# EasyEDA schematic SCH_PresenceIndicator_2021-10-22.json
TITLE: Presence Indicator; REV: 0.1; Date: 2021-10-22; Sheet: 1/1; Company: Pedro Torrezão
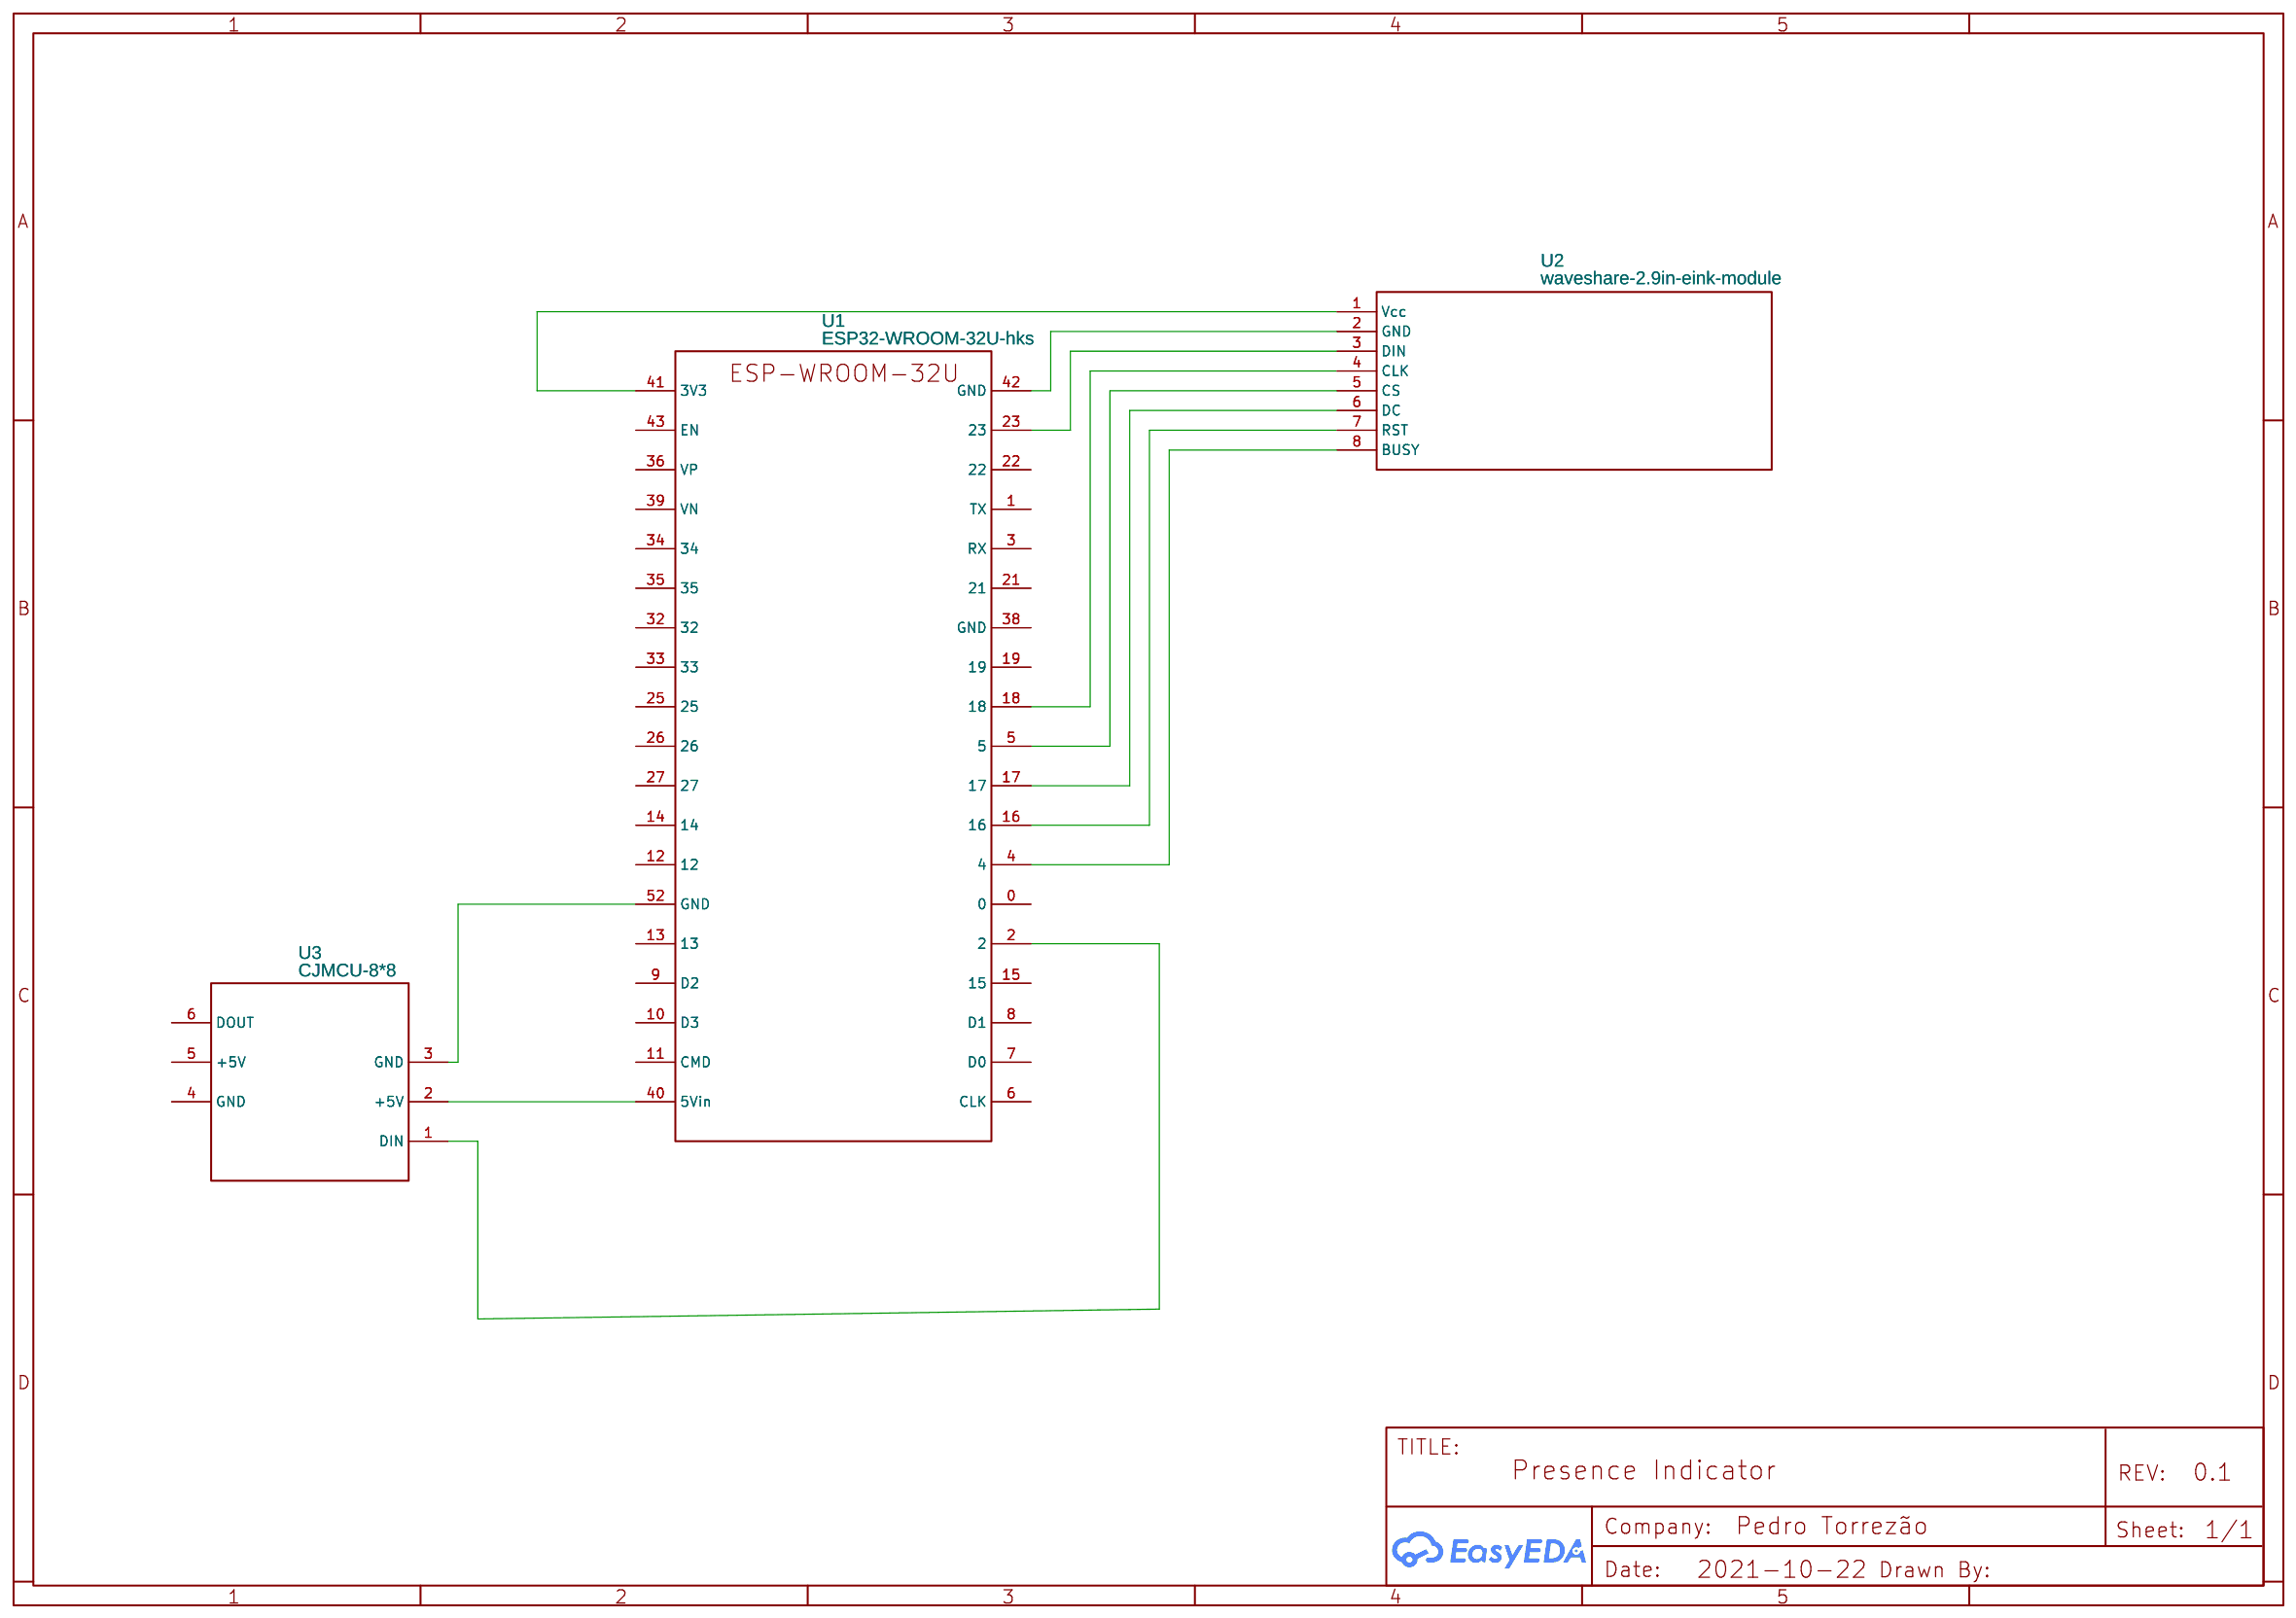
[diagram p0: schematic sheet]

## Parts
U1  ESP32-WROOM-32U-hks  [ESP32-DEVKITC-V4-HKSMONAR2]
U2  waveshare-2.9in-eink-module  [WAVESHARE-2.9IN-EINK-MODULE]
U3  CJMCU-8*8  [CJMCU-8*8]

## Library data of the parts
U1 = ESP32-WROOM-32U-hks: Manufacturer: Espressif Systems; Manufacturer Part: ESP32-DevKitC; Supplier: Mouser; Supplier Part: 356-ESP32-DEVKITC; link: http://esp-idf.readthedocs.io/en/latest/get-started/get-started-devkitc.html; Contributor: hksmonaro
U2 = waveshare-2.9in-eink-module: Manufacturer: waveshare; Manufacturer Part: 2.9inch e-Paper Module (B); Supplier: amazon; link: https://www.waveshare.com/wiki/2.9inch_e-Paper_Module_(B); Contributor: Neegu0Sh
U3 = CJMCU-8*8: Contributor: bacto

## Nets
Net-(U1-2): U1.2 U3.1(DIN)
Net-(U1-4): U1.4 U2.8(BUSY)
Net-(U1-5): U1.5 U2.5(CS)
Net-(U1-16): U1.16 U2.7(RST)
Net-(U1-17): U1.17 U2.6(DC)
Net-(U1-18): U1.18 U2.4(CLK)
Net-(U1-23): U1.23 U2.3(DIN)
Net-(U1-40): U1.40(5Vin) U3.2(+5V)
Net-(U1-41): U1.41(3V3) U2.1(Vcc)
Net-(U1-42): U1.42(GND) U2.2(GND)
Net-(U1-52): U1.52(GND) U3.3(GND)

Not connected (* = marked no-connect by the designer): U1 0 1(TX) 3(RX) 6(CLK) 7(D0) 8(D1) 9(D2) 10(D3) 11(CMD) 12 13 14 15 19 21 22 25 26 27 32 33 34 35 36(VP) 38(GND) 39(VN) 43(EN); U3 4(GND) 5(+5V) 6(DOUT)
